# EAGLE design poweruptimer (EAGLE 6.4)
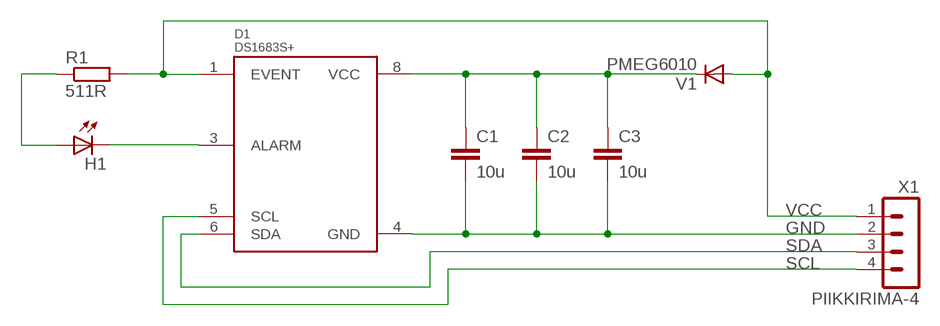
[diagram p0: schematic, sheet 1]

## Parts
C1  10u  C-EUC0805  [C0805]
C2  10u  C-EUC0805  [C0805]
C3  10u  C-EUC0805  [C0805]
D1  DS1683S+  [SOIC8-N_MC]
H1  LEDCHIP-LED0603  [CHIP-LED0603]
R1  511R  R-EU_R0603  [R0603]
V1  PMEG6010  DIODE-SOD323-R  [SOD323-R]
X1  PIIKKIRIMA-4  [PIIKKIRIMA-4]

## Nets
GND: C1.2 C2.2 C3.2 D1.4(GND) X1.2
N$1: C1.1 C2.1 C3.1 D1.8(VCC) V1.C
N$4: D1.3(ALARM) H1.C
N$5: H1.A R1.1
SCL: D1.5(SCL) X1.4
SDA: D1.6(SDA) X1.3
VCC: D1.1(EVENT) R1.2 V1.A X1.1

## Library data of the parts
C1-C3 = rcl:C-EU: CAPACITOR, European symbol
D1 = OMAT_IC:DS1683
H1 = OMAT_IC:LED: LED OSRAM: - CHIPLED LG R971, LG N971, LY N971, LG Q971, LY Q971, LO R971, LY R971 LH N974, LH R974 LS Q976, LO Q976, LY Q976 LO Q996 - Hyper CHIPLED LW Q18S LB Q993, LB Q99A, LB R99A - SideLED LS A670, LO A670, LY A670, LG A670, LP A670 LB A673, LV A673, LT A673, LW A673 LH A674 LY A675 LS A676, LA A676, LO A676, LY A676, LW A676 LS A679, LY A679, LG A679 - Hyper Micro SIDELED® LS Y876, LA Y876, LO Y876, LY Y876 LT Y87S - SmartLED LW L88C, LW L88S LB L89C, LB L89S, LG L890 LS L89K, LO L89K, LY L89K LS L896, LA L896, LO L896, LY L896 - TOPLED LS T670, LO T670, LY T670, LG T670, LP T670 LSG T670, LSP T670, LSY T670, LOP T670, LYG T670 LG T671, LOG T671, LSG T671 LB T673, LV T673, LT T673, LW T673 LH T674 LS T676, LA T676, LO T676, LY T676, LB T676, LH T676, LSB T676, LW T676 LB T67C, LV T67C, LT T67C, LS T67K, LO T67K, LY T67K, LW E67C LS E67B, LA E67B, LO E67B, LY E67B, LB E67C, LV E67C, LT E67C LW T67C LS T679, LY T679, LG T679 LS T770, LO T770, LY T770, LG T770, LP T770 LB T773, LV T773, LT T773, LW T773 LH T774 LS E675, LA E675, LY E675, LS T675 LS T776, LA T776, LO T776, LY T776, LB T776 LHGB T686 LT T68C, LB T68C - Hyper Mini TOPLED® LB M676 - Mini TOPLED Santana® LG M470 LS M47K, LO M47K, LY M47K Source: http://www.osram.convergy.de LUXEON: - LUMILED® LXK2-PW12-R00, LXK2-PW12-S00, LXK2-PW14-U00, LXK2-PW14-V00 LXK2-PM12-R00, LXK2-PM12-S00, LXK2-PM14-U00 LXK2-PE12-Q00, LXK2-PE12-R00, LXK2-PE12-S00, LXK2-PE14-T00, LXK2-PE14-U00 LXK2-PB12-K00, LXK2-PB12-L00, LXK2-PB12-M00, LXK2-PB14-N00, LXK2-PB14-P00, LXK2-PB14-Q00 LXK2-PR12-L00, LXK2-PR12-M00, LXK2-PR14-Q00, LXK2-PR14-R00 LXK2-PD12-Q00, LXK2-PD12-R00, LXK2-PD12-S00 LXK2-PH12-R00, LXK2-PH12-S00 LXK2-PL12-P00, LXK2-PL12-Q00, LXK2-PL12-R00 Source: www.luxeon.com KINGBRIGHT: KA-3528ASYC Source: www.kingbright.com
R1 = rcl:R-EU_: RESISTOR, European symbol
V1 = diode:DIODE-: DIODE
X1 = OMAT_IC:PIIKKIRIMA-4

## Board
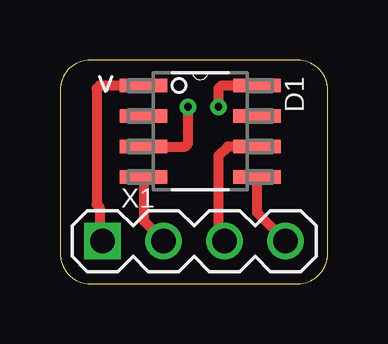
[diagram p1: board, top side]
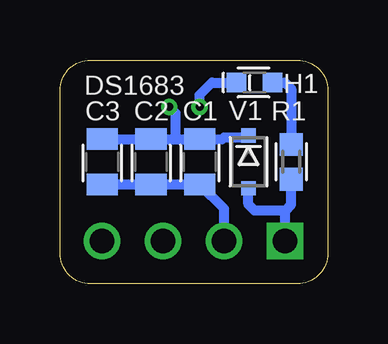
[diagram p2: board, bottom side, seen from below]

Size 11.16 x 9.32 mm. Coordinates in mm from the lower left corner, seen from the top.
Outline: 0,8.05 0,1.27 arc90 1.27,0 9.89,0 arc90 11.16,1.27 11.16,8.05 arc90 9.89,9.32 1.27,9.32 arc90 0,8.05
Copper layers (1*16): Top 0.0356mm / dielectric 1.5011mm / Bottom 0.0356mm
Design rules "LaenPCBOrder": minimum track width 6mil, minimum drill 13mil, track to track 6mil, track to pad 6mil, pad to pad 6mil, via to via 6mil, smd to smd 6mil, copper to edge 15mil, drill to drill 6mil, minimum pad ring 7mil, minimum via ring 7mil, stop-mask expansion 4mil, vias tented up to drill 0mil, thermal gap 10mil

### Footprints (pad centres in the part's own frame; a part is rotated, then mirrored left to right if it is on the bottom)
C0805 = smd 0.9 x 1.3: 1 -0.95,0; 2 0.95,0
SOIC8-N_MC = smd 1.981 x 0.559: 1 -2.362,1.905; 2 -2.362,0.635; 3 -2.362,-0.635; 4 -2.362,-1.905; 5 2.362,-1.905; 6 2.362,-0.635; 7 2.362,0.635; 8 2.362,1.905
CHIP-LED0603 = smd 0.8 x 0.8: A -0.75,0; C 0.75,0
R0603 = smd 0.95 x 0.95: 1 -0.725,0; 2 0.725,0
SOD323-R = smd 0.6 x 0.6: A 1.1,0; C -1.1,0
PIIKKIRIMA-4 = drill 1.016 square: 1 0,0 | drill 1.016: 2 2.54,0; 3 5.08,0; 4 7.62,0

### Placement (x,y rotation side)
C1  5.33,5.08 270 bottom
C2  7.37,5.08 270 bottom
C3  9.4,5.08 270 bottom
D1  5.84,6.35 0 top
H1  3.05,8.38 180 bottom
R1  1.52,5.08 270 bottom
V1  3.3,5.08 270 bottom
X1  1.78,1.78 0 top

### Tracks (layer width: path | path; a pad name or v marks a point on that pad's centre or on a via)
GND
  Top 0.406: D1.4 3.48,2.62 X1.2
  Bottom 0.406: X1.2 4.32,3.11 C1.2 C2.2 C3.2
N$1  (via drill 0.33)
  Top 0.406: D1.8 6.73,8.25 6.6,8.13 v6.6,7.37
  Bottom 0.406: C3.1 C2.1 6.35,6.03 | 6.35,6.03 C1.1 4.38,6.03 4.32,6.1 3.39,6.1 V1.C | v6.6,7.37 6.35,7.11 6.35,6.03
N$4  (via drill 0.33)
  Top 0.406: D1.3 5.21,5.71 5.33,5.84 v5.33,7.37
  Bottom 0.406: v5.33,7.37 5.33,7.87 4.83,8.38 H1.C
N$5
  Bottom 0.406: H1.A 1.78,8.38 1.52,8.13 R1.1
SCL
  Top 0.406: D1.5 8.2,2.97 X1.4
SDA
  Top 0.406: D1.6 6.99,5.71 6.6,5.33 6.6,2.03 X1.3
VCC
  Top 0.406: D1.1 1.65,8.25 1.52,8.13 1.52,3.3 1.65,3.17 1.65,1.9 X1.1
  Bottom 0.406: X1.1 1.78,3.05 | 1.78,3.05 1.52,3.3 R1.2 | 1.78,3.05 3.05,3.05 3.3,3.3 V1.A

### Text on the board
bPlace: DS1683